# EAGLE design psu-analog (EAGLE 6.6.0)
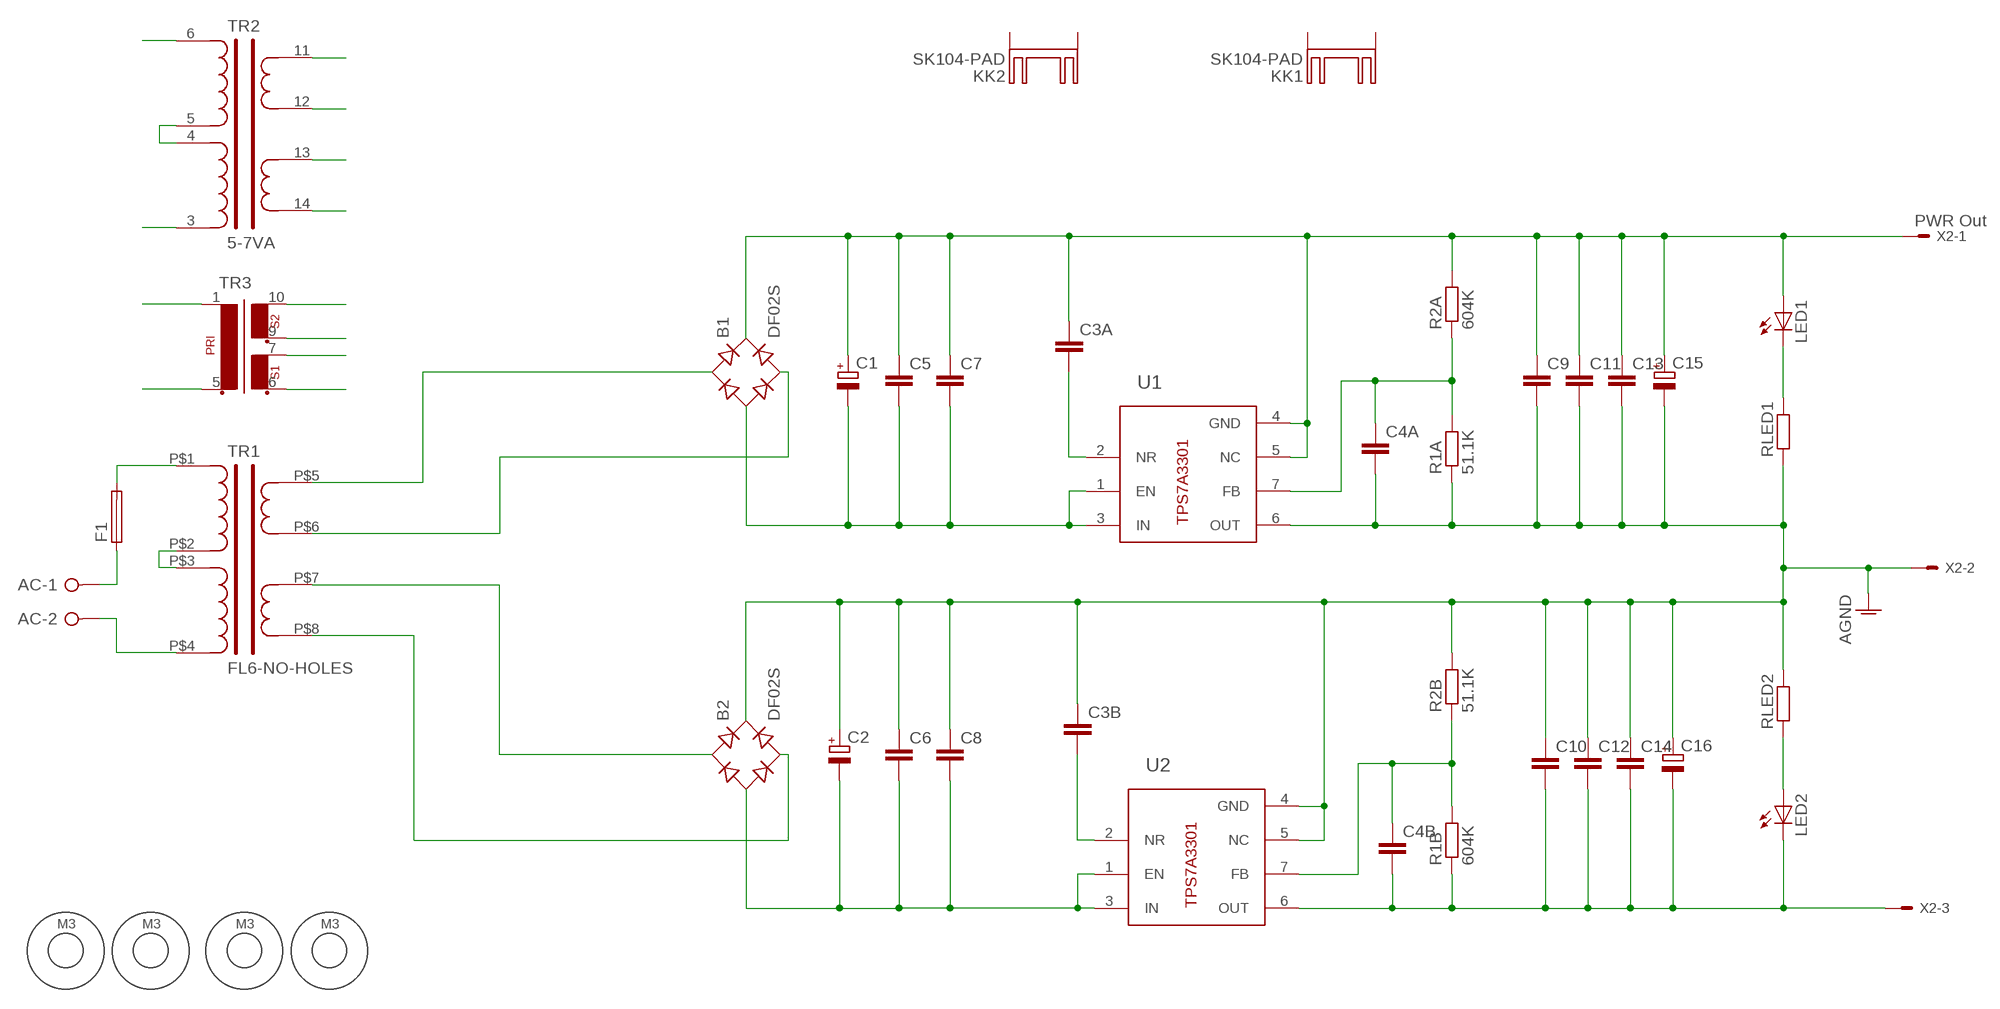
[diagram p0: schematic, sheet 1]

## Parts
AC  W237-02P  [W237-132]
B1  DF02S  [DFS]
B2  DF02S  [DFS]
C1  CPOL-EUE7.5-18  [E7,5-18]
C2  CPOL-EUE7.5-18  [E7,5-18]
C3A  C-EUC1206  [C1206]
C3B  C-EUC1206  [C1206]
C4A  C-EUC1206  [C1206]
C4B  C-EUC1206  [C1206]
C5  C-EUC1206  [C1206]
C6  C-EUC1206  [C1206]
C7  C-EUC1206  [C1206]
C8  C-EUC1206  [C1206]
C9  C-EUC1206  [C1206]
C10  C-EUC1206  [C1206]
C11  C-EUC1206  [C1206]
C12  C-EUC1206  [C1206]
C13  C-EUC1206  [C1206]
C14  C-EUC1206  [C1206]
C15  CPOL-EUE5-13  [E5-13]
C16  CPOL-EUE5-13  [E5-13]
F1  GSH15  [GSH15]
KK1  SK104-PAD  [SK104-PAD]
KK2  SK104-PAD  [SK104-PAD]
LED1  LEDSMT1206  [1206]
LED2  LEDSMT1206  [1206]
R1A  51.1K  R-EU_R1206  [R1206]
R1B  604K  R-EU_R1206  [R1206]
R2A  604K  R-EU_R1206  [R1206]
R2B  51.1K  R-EU_R1206  [R1206]
RLED1  R-EU_R1206  [R1206]
RLED2  R-EU_R1206  [R1206]
TR1  FL6-NO-HOLES  [FL6-NO-HOLES]
TR2  5-7VA  [5_7VA-PC]
TR3  EI42-2  [EI42-2]
U1  TPS7A3301KC-OTHER-PACKAGE  [7TO-220-OTHER]
U2  TPS7A3301KC-OTHER-PACKAGE  [7TO-220-OTHER]
U$1  M3_HOLE  [M3_HOLE]
U$2  M3_HOLE  [M3_HOLE]
U$3  M3_HOLE  [M3_HOLE]
U$4  M3_HOLE  [M3_HOLE]
X2  PWR Out  22-23-2031  [22-23-2031]

## Nets
AGND: B2.+ C2.+ C3B.1 C4A.2 C6.1 C8.1 C9.2 C10.1 C11.2 C12.1 C13.2 C14.1 C15.- C16.+ R1A.1 R2B.2 RLED1.1 RLED2.2 U1.6(OUT) U2.4(GND) U2.5(NC) X2.2
N$1: TR1.P$2(PRI1B) TR1.P$3(PRI2A) TR2.4 TR2.5
N$2: F1.2 TR1.P$1(PRI1A) TR2.6 TR3.1
N$3: AC.2 TR1.P$4(PRI2B) TR2.3 TR3.5
N$4: AC.1 F1.1
N$6: LED2.A RLED2.1
N$8: LED1.C RLED1.2
N$9: C4A.1 R1A.2 R2A.1 U1.7(FB)
N$10: C3B.2 U2.2(NR)
N$11: C4B.1 R1B.2 R2B.1 U2.7(FB)
N$13: B1.AC2 TR1.P$6(SEC1B) TR2.12 TR3.9
N$14: B1.AC1 TR1.P$5(SEC1A) TR2.11 TR3.10
N$15: B2.AC2 TR1.P$8(SEC2B) TR2.14 TR3.6
N$16: C3A.2 U1.2(NR)
N$21: B2.AC1 TR1.P$7(SEC2A) TR2.13 TR3.7
N$22: C4B.2 C10.2 C12.2 C14.2 C16.- LED2.C R1B.1 U2.6(OUT) X2.3
N$24: B1.+ C1.+ C3A.1 C5.1 C7.1 C9.1 C11.1 C13.1 C15.+ LED1.A R2A.2 U1.4(GND) U1.5(NC) X2.1
VIN+: B1.- C1.- C5.2 C7.2 U1.1(EN) U1.3(IN)
VIN-: B2.- C2.- C6.2 C8.2 U2.1(EN) U2.3(IN)
Unconnected: KK1.K1(K) KK1.K2(K) KK2.K1(K) KK2.K2(K)

## Library data of the parts
AC = con-wago-508:W237-02P: WAGO SREW CLAMP; OC_FARNELL: unknown; OC_NEWARK: unknown
B1 B2 = rectifier:DF*S: Surface Mount Glass Passivated Bridge Rectifiers Source: Source: Comchip Bridge Rectifiers DF005S-G thru DF10S-G.pdf
C1 C2 C15 C16 = rcl:CPOL-EU: POLARIZED CAPACITOR, European symbol
C3A C3B C4A C4B C5-C14 = rcl:C-EU: CAPACITOR, European symbol
F1 = fuse:GSH15: FUSE HOLDER grid 15mm, 19649 Wickmann; MPN: 64900001039; OC_FARNELL: 1271673; OC_NEWARK: 02P0318
KK1 KK2 = heatsink:SK104-PAD: HEATSINK manufacturer Fischer/distributor Buerklin
LED1 LED2 = led:LED: LED OSRAM: - CHIPLED LG R971, LG N971, LY N971, LG Q971, LY Q971, LO R971, LY R971 LH N974, LH R974 LS Q976, LO Q976, LY Q976 LO Q996 - Hyper CHIPLED LW Q18S LB Q993, LB Q99A, LB R99A - SideLED LS A670, LO A670, LY A670, LG A670, LP A670 LB A673, LV A673, LT A673, LW A673 LH A674 LY A675 LS A676, LA A676, LO A676, LY A676, LW A676 LS A679, LY A679, LG A679 - Hyper Micro SIDELED® LS Y876, LA Y876, LO Y876, LY Y876 LT Y87S - SmartLED LW L88C, LW L88S LB L89C, LB L89S, LG L890 LS L89K, LO L89K, LY L89K LS L896, LA L896, LO L896, LY L896 - TOPLED LS T670, LO T670, LY T670, LG T670, LP T670 LSG T670, LSP T670, LSY T670, LOP T670, LYG T670 LG T671, LOG T671, LSG T671 LB T673, LV T673, LT T673, LW T673 LH T674 LS T676, LA T676, LO T676, LY T676, LB T676, LH T676, LSB T676, LW T676 LB T67C, LV T67C, LT T67C, LS T67K, LO T67K, LY T67K, LW E67C LS E67B, LA E67B, LO E67B, LY E67B, LB E67C, LV E67C, LT E67C LW T67C LS T679, LY T679, LG T679 LS T770, LO T770, LY T770, LG T770, LP T770 LB T773, LV T773, LT T773, LW T773 LH T774 LS E675, LA E675, LY E675, LS T675 LS T776, LA T776, LO T776, LY T776, LB T776 LHGB T686 LT T68C, LB T68C - Hyper Mini TOPLED® LB M676 - Mini TOPLED Santana® LG M470 LS M47K, LO M47K, LY M47K Source: http://www.osram.convergy.de LUXEON: - LUMILED® LXK2-PW12-R00, LXK2-PW12-S00, LXK2-PW14-U00, LXK2-PW14-V00 LXK2-PM12-R00, LXK2-PM12-S00, LXK2-PM14-U00 LXK2-PE12-Q00, LXK2-PE12-R00, LXK2-PE12-S00, LXK2-PE14-T00, LXK2-PE14-U00 LXK2-PB12-K00, LXK2-PB12-L00, LXK2-PB12-M00, LXK2-PB14-N00, LXK2-PB14-P00, LXK2-PB14-Q00 LXK2-PR12-L00, LXK2-PR12-M00, LXK2-PR14-Q00, LXK2-PR14-R00 LXK2-PD12-Q00, LXK2-PD12-R00, LXK2-PD12-S00 LXK2-PH12-R00, LXK2-PH12-S00 LXK2-PL12-P00, LXK2-PL12-Q00, LXK2-PL12-R00 Source: www.luxeon.com KINGBRIGHT: KA-3528ASYC Source: www.kingbright.com
R1A R1B R2A R2B RLED1 RLED2 = rcl:R-EU_: RESISTOR, European symbol
TR1 = trafo-block:FL6-NO-HOLES
TR2 = trafo-amveco:5-7VA: 5 and 7 VA toroidal PC-mount transformer
TR3 = trafo:EI42-2: TRANSFORMER 1 primary winding, 2 secondary windings ERA
U1 U2 = TPS7A33:TPS7A3301KC-OTHER-PACKAGE
U$1-U$4 = mouting-holes:M3_HOLE: A mounting hole for an M3 screw with an enlarged restrict area.
X2 = con-molex:22-23-2031: .100" (2.54mm) Center Header - 3 Pin; MF: MOLEX; MPN: 22-23-2031; OC_FARNELL: 1462950; OC_NEWARK: 30C0862

## Board
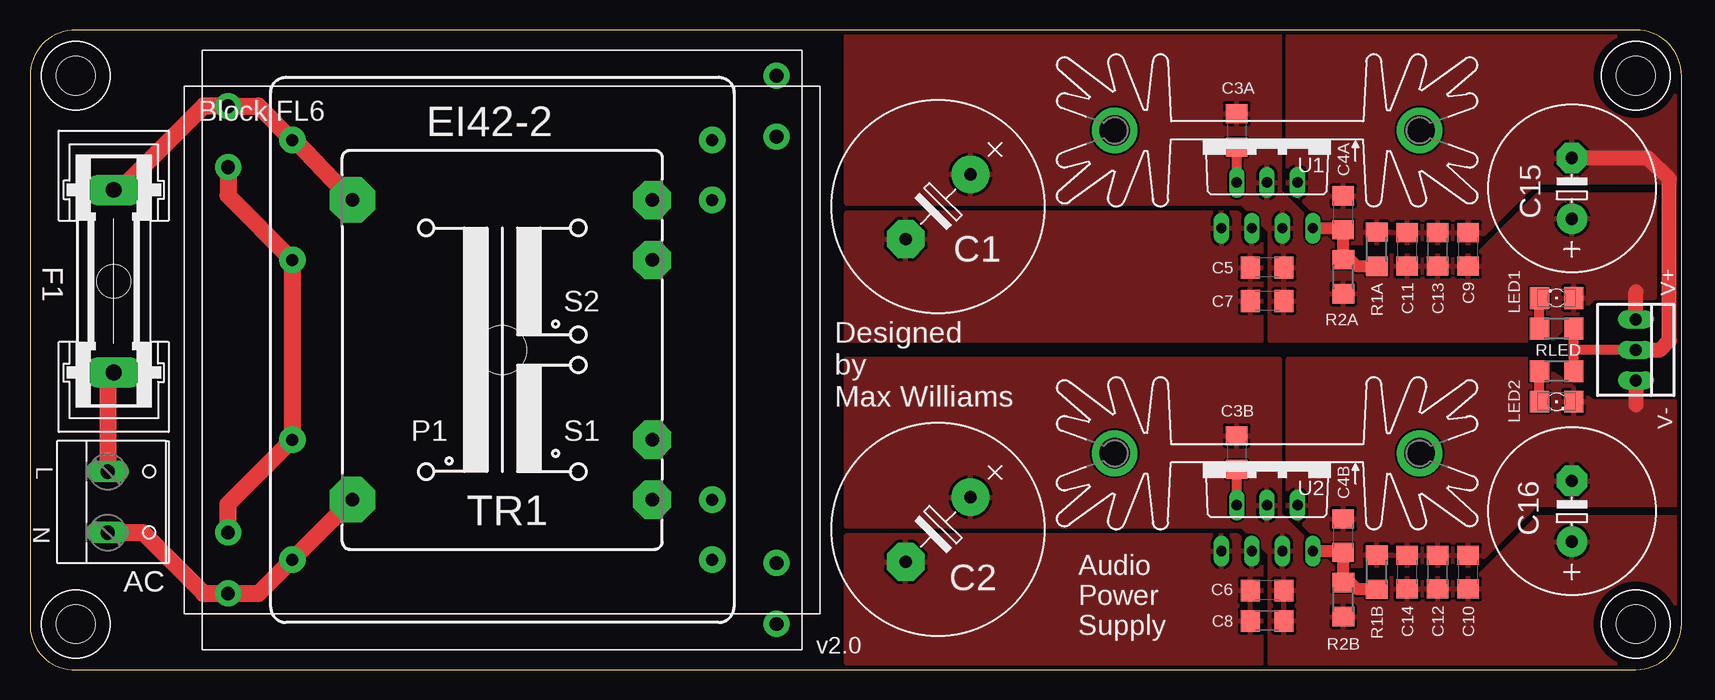
[diagram p1: board, top side]
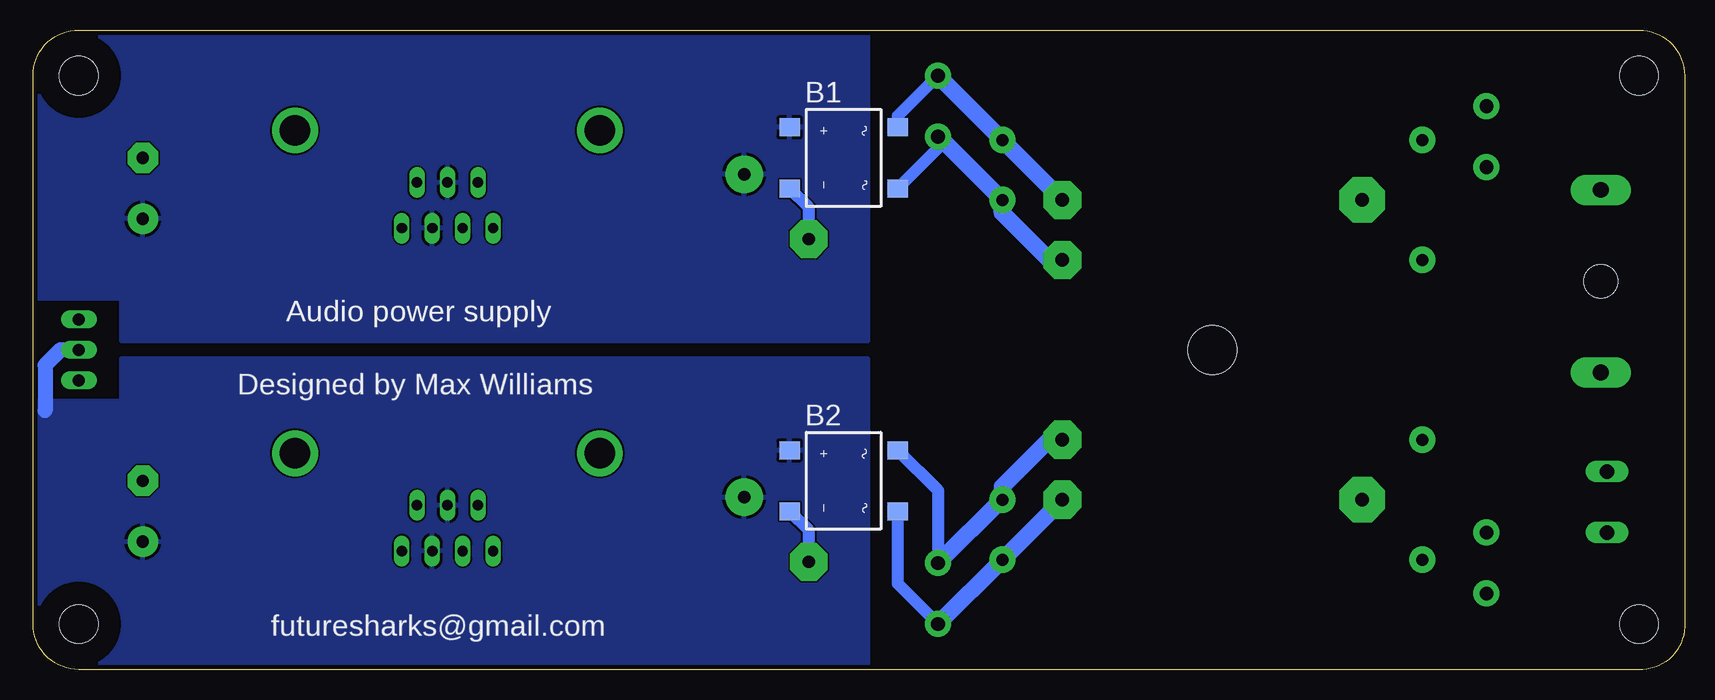
[diagram p2: board, bottom side, seen from below]

Size 137.67 x 53.34 mm. Coordinates in mm from the lower left corner, seen from the top.
Outline: 0,3.56 arc90 3.81,0 133.86,0 arc90 137.67,3.81 137.67,49.53 arc90 133.86,53.34 3.81,53.34 arc90 0,49.53 0,3.56
Copper layers (1*16): Top 0.0356mm / dielectric 1.5011mm / Bottom 0.0356mm
Design rules "oshpark-2layer": minimum track width 6mil, minimum drill 13mil, track to track 6mil, track to pad 6mil, pad to pad 6mil, via to via 6mil, smd to smd 6mil, copper to edge 15mil, drill to drill 6mil, minimum pad ring 7mil, minimum via ring 7mil, stop-mask expansion 2.5mil, vias tented up to drill 0mil, thermal gap 10mil

### Footprints (pad centres in the part's own frame; a part is rotated, then mirrored left to right if it is on the bottom)
W237-132 = drill 1.194 long: 1 -2.54,-0.635; 2 2.54,-0.635
DFS = smd 1.5 x 1.7: + -2.55,-4.5; - 2.55,-4.5; AC1 -2.55,4.5; AC2 2.55,4.5
E7,5-18 = drill 1.016 pad 3.15: + -3.81,0 | drill 1.016 pad 3.15 octagon: - 3.81,0
C1206 = smd 1.6 x 1.8: 1 -1.4,0; 2 1.4,0
E5-13 = drill 1.016 pad 2.54: + -2.54,0 | drill 1.016 pad 2.54 octagon: - 2.54,0
GSH15 = drill 1.321 pad 2.54 long: 1 -7.62,0; 2 7.62,0 | hole 2.794: 0,0
SK104-PAD = drill 2.54 pad 3.81: K1 -12.7,-0.762; K2 12.7,-0.762
1206 = smd 1.6 x 1.803: A -1.422,0; C 1.422,0
R1206 = smd 1.6 x 1.803: 1 -1.422,0; 2 1.422,0
FL6-NO-HOLES = drill 1 pad 2.184: P$1 -17.5,17.5; P$2 -17.5,7.5; P$3 -17.5,-7.5; P$4 -17.5,-17.5; P$5 17.5,17.5; P$6 17.5,12.5; P$7 17.5,-12.5; P$8 17.5,-17.5
5_7VA-PC = drill 1.143 pad 2.159: 3 -22.86,-20.32; 4 -22.86,-15.24; 5 -22.86,15.24; 6 -22.86,20.32; 11 22.86,22.86; 12 22.86,17.78; 13 22.86,-17.78; 14 22.86,-22.86 | hole 4.064: 0,0
EI42-2 = drill 1.118 pad 3.81 octagon: 1 -12.497,12.497; 5 -12.497,-12.497 | drill 1.118 pad 3.175 octagon: 6 12.497,-12.497; 7 12.497,-7.493; 9 12.497,7.493; 10 12.497,12.497
7TO-220-OTHER = drill 0.864 pad 1.27 long: 1 -3.81,-7.382; 2 -2.54,-3.572; 3 -1.27,-7.382; 4 0,-3.572; 5 1.27,-7.382; 6 2.54,-3.572; 7 3.81,-7.382
M3_HOLE = hole 3.2: 0,0
22-23-2031 = drill 1 long: 1 -2.54,0; 2 0,0; 3 2.54,0

### Placement (x,y rotation side)
AC  7.11,13.97 270 top
B1  70.1,42.67 270 bottom
B2  70.1,15.75 270 bottom
C1  75.69,38.61 225 top
C2  75.69,11.68 225 top
C3A  100.58,44.96 270 top
C3B  100.58,18.1 270 top
C4A  109.47,38.1 90 top
C4B  109.47,11.18 90 top
C5  103.12,33.53 180 top
C6  103.12,6.6 180 top
C7  103.12,30.73 180 top
C8  103.12,4.06 180 top
C9  117.35,35.05 90 top
C10  119.89,8.13 90 top
C11  114.81,35.05 90 top
C12  117.35,8.13 90 top
C13  119.89,35.05 90 top
C14  114.81,8.13 90 top
C15  128.52,40.13 90 top
C16  128.52,13.21 90 top
F1  6.99,32.38 90 top
KK1  103.12,44.2 180 top
KK2  103.12,17.27 180 top
LED1  127.25,30.99 180 top
LED2  127.25,22.35 0 top
R1A  112.27,35.05 270 top
R1B  112.27,8.13 270 top
R2A  109.47,32.77 270 top
R2B  109.47,5.84 270 top
RLED1  127.25,28.45 180 top
RLED2  127.25,24.89 0 top
TR1  39.37,26.67 0 top
TR2  39.37,26.67 0 top
TR3  39.37,26.67 0 top
U1  103.12,44.2 0 top
U2  103.12,17.27 0 top
U$1  133.86,49.53 0 top
U$2  3.81,49.53 0 top
U$3  3.81,3.81 0 top
U$4  133.86,3.81 0 top
X2  133.86,26.67 270 top

### Tracks (layer width: path | path; a pad name or v marks a point on that pad's centre or on a via)
AGND
  Top 0.813: X2.2 128.68,26.67 | 128.78,28.35 RLED1.1 128.68,26.67 | RLED2.2 128.68,26.67
  Top 1.27: X2.2 135.89,26.67 136.65,27.43 136.65,40.89 134.87,42.67 C15.-
  Bottom 1.27: X2.2 135.38,26.67 136.65,25.4 136.65,21.59
  pour Top: 104.9,53.09 137.41,53.09 137.16,40.64 125.48,40.64 120.4,35.56 109.73,35.56 104.9,40.39
  pour Top: 68.07,25.91 104.14,25.91 104.14,12.95 109.47,7.62 120.65,7.62 125.73,12.7 137.16,12.7 137.41,0.51 103.38,0.51 103.38,9.65 101.09,11.94 68.07,11.94
  pour Bottom: 68.07,25.91 130.3,25.91 130.3,22.35 137.41,22.35 137.41,0.51 68.07,0.51
N$1
  Top 1.422: TR2.5 16.51,39.53 TR1.P$2 TR1.P$3 16.51,13.81 TR2.4
N$2
  Top 1.422: TR1.P$1 19.05,46.99 TR2.6 14.48,46.99 7.49,40.01 F1.2 | 22.12,44.17 TR3.1
  Top 1.676: TR1.P$1 22.12,44.17
N$3
  Top 1.422: TR3.5 TR1.P$4 19.05,6.35 TR2.3 14.48,6.35 9.4,11.43 AC.2
N$4
  Top 1.422: F1.1 6.48,24.26 AC.1
N$6
  Top 0.813: LED2.A RLED2.1
N$8
  Top 0.813: RLED1.2 LED1.C
N$9
  Top 1.016: U1.7 109.1,36.83 | 109.1,36.83 C4A.1 | R2A.1 109.47,34.8 | 109.47,34.8 109.47,36.45 109.1,36.83 | R1A.2 110.64,33.63 109.47,34.8
N$10
  Top 0.813: U2.2 C3B.2
N$11
  Top 1.016: U2.7 109.1,9.91 C4B.1 R2B.1 109.58,7.37 109.98,7.37 110.64,6.71 R1B.2
N$13
  Bottom 1.016: TR2.12 62.23,43.5 B1.AC2
  Bottom 1.27: 57.12,38.92 TR1.P$6 56.99,39.05
  Bottom 1.422: TR3.9 52.96,34.16 56.9,38.1 56.9,39.14 | 62.15,44.45 TR1.P$6 | 65.59,40.13 B1.AC2
  Bottom 1.676: 56.9,39.14 TR1.P$6 | TR2.12 62.15,44.45
N$14
  Bottom 1.016: TR2.11 65.6,46.16 B1.AC1
  Bottom 1.422: TR3.10 TR1.P$5 TR2.11
N$15
  Bottom 1.016: B2.AC2 65.6,7.18 TR2.14
  Bottom 1.422: TR3.6 TR1.P$8 TR2.14
N$16
  Top 0.813: U1.2 C3A.2
N$21
  Bottom 1.016: TR2.13 62.23,14.92 B2.AC1
  Bottom 1.422: TR3.7 52.96,19.18 56.9,15.24 56.9,14.2 | 56.95,14.17 TR2.13
  Bottom 1.676: 56.9,14.2 TR1.P$7 56.95,14.17
N$22
  Top 1.27: X2.3 133.86,22.1
  pour Top: 104.9,25.91 125.22,25.91 130.3,22.35 137.16,22.35 137.16,13.72 125.48,13.72 120.4,8.64 109.73,8.64 104.9,13.46
N$24
  Top 1.27: X2.1 133.86,31.5
  pour Top: 68.07,53.09 104.14,53.09 104.14,39.88 109.47,34.54 120.65,34.54 125.73,39.62 135.38,39.62 135.38,30.99 130.3,30.99 126.75,27.43 103.38,27.43 103.38,36.58 101.09,38.86 68.07,38.86
  pour Bottom: 68.07,53.09 137.41,53.09 137.41,30.99 130.3,30.99 130.3,27.43 68.07,27.43
VIN+
  Bottom 1.016: C1.- 73,38.52 B1.-
  pour Top: 102.62,27.43 68.07,27.43 68.07,38.1 100.58,38.1 102.62,36.07
VIN-
  Bottom 1.016: C2.- 73,11.59 B2.-
  pour Top: 102.62,0.51 68.07,0.51 68.07,11.18 100.58,11.18 102.62,9.14

### Text on the board
tPlace: V+ | V-
tNames: RLED | Designed / by / Max Williams | L | N | Audio / Power / Supply | v2.0
bNames: Audio power supply | Designed by Max Williams | futuresharks@gmail.com